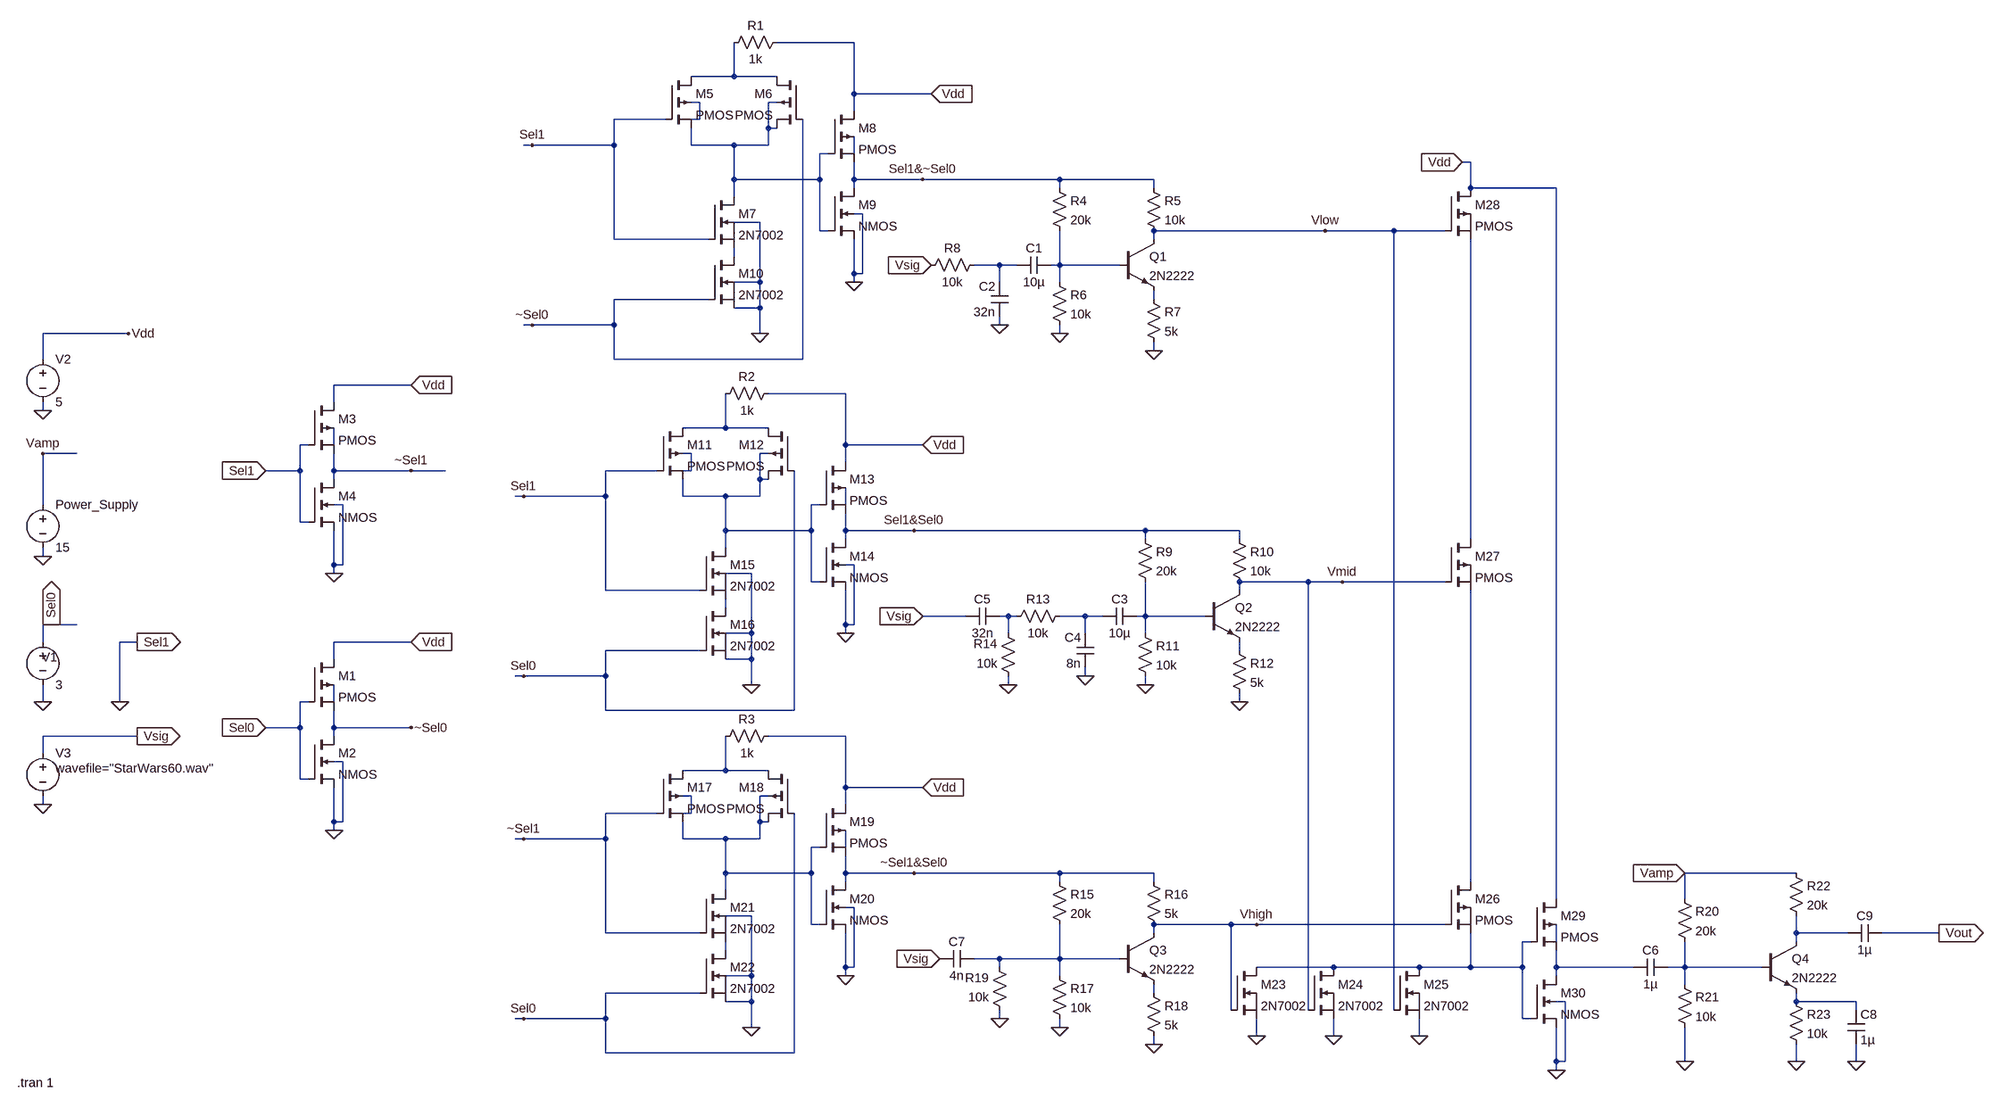
[diagram p0: schematic FinalDraft.asc]
FinalDraft.asc, the LTspice schematic file:
Version 4
SHEET 1 2692 1464
WIRE 176 -496 32 -496
WIRE -48 -432 -48 -496
WIRE -48 -432 -128 -432
WIRE 32 -432 -48 -432
WIRE 176 -400 176 -496
WIRE 320 -400 176 -400
WIRE -112 -384 -128 -384
WIRE 32 -384 16 -384
WIRE 176 -368 176 -400
WIRE -176 -352 -272 -352
WIRE -112 -352 -112 -384
WIRE -112 -352 -128 -352
WIRE 16 -336 16 -384
WIRE 32 -336 16 -336
WIRE -512 -304 -528 -304
WIRE -272 -304 -272 -352
WIRE -272 -304 -512 -304
WIRE -128 -304 -128 -336
WIRE -48 -304 -128 -304
WIRE 16 -304 16 -336
WIRE 16 -304 -48 -304
WIRE 128 -288 112 -288
WIRE 176 -288 176 -320
WIRE 1328 -272 1312 -272
WIRE -48 -240 -48 -304
WIRE 112 -240 112 -288
WIRE 112 -240 -48 -240
WIRE 176 -240 176 -272
WIRE 304 -240 176 -240
WIRE 560 -240 304 -240
WIRE 736 -240 560 -240
WIRE 176 -224 176 -240
WIRE 560 -224 560 -240
WIRE 736 -224 736 -240
WIRE 1328 -224 1328 -272
WIRE 1488 -224 1328 -224
WIRE -48 -208 -48 -240
WIRE 192 -176 176 -176
WIRE 0 -160 -48 -160
WIRE 112 -144 112 -240
WIRE 128 -144 112 -144
WIRE 1056 -144 736 -144
WIRE 1184 -144 1056 -144
WIRE 1280 -144 1184 -144
WIRE -272 -128 -272 -304
WIRE -96 -128 -272 -128
WIRE 736 -128 736 -144
WIRE -48 -96 -48 -112
WIRE 448 -80 400 -80
WIRE 480 -80 448 -80
WIRE 560 -80 560 -144
WIRE 560 -80 544 -80
WIRE 672 -80 560 -80
WIRE 176 -64 176 -128
WIRE 192 -64 192 -176
WIRE 192 -64 176 -64
WIRE 0 -48 0 -160
WIRE 0 -48 -48 -48
WIRE 176 -48 176 -64
WIRE 448 -48 448 -80
WIRE 560 -48 560 -80
WIRE -96 -16 -272 -16
WIRE 736 -16 736 -32
WIRE 0 0 0 -48
WIRE 0 0 -48 0
WIRE -512 32 -528 32
WIRE -272 32 -272 -16
WIRE -272 32 -512 32
WIRE 448 32 448 16
WIRE -1296 48 -1456 48
WIRE 0 48 0 0
WIRE 560 48 560 32
WIRE 736 80 736 64
WIRE -1456 96 -1456 48
WIRE -272 96 -272 32
WIRE 80 96 80 -352
WIRE 80 96 -272 96
WIRE -768 144 -912 144
WIRE 160 160 16 160
WIRE -912 176 -912 144
WIRE -1456 192 -1456 176
WIRE -64 224 -64 160
WIRE -64 224 -144 224
WIRE 16 224 -64 224
WIRE -960 256 -976 256
WIRE -912 256 -912 224
WIRE 160 256 160 160
WIRE 304 256 160 256
WIRE -1392 272 -1456 272
WIRE -128 272 -144 272
WIRE 16 272 0 272
WIRE 160 288 160 256
WIRE -976 304 -976 256
WIRE -976 304 -1040 304
WIRE -912 304 -912 272
WIRE -768 304 -912 304
WIRE -704 304 -768 304
WIRE -192 304 -288 304
WIRE -128 304 -128 272
WIRE -128 304 -144 304
WIRE -912 320 -912 304
WIRE 0 320 0 272
WIRE 16 320 0 320
WIRE -528 352 -544 352
WIRE -288 352 -288 304
WIRE -288 352 -528 352
WIRE -144 352 -144 320
WIRE -64 352 -144 352
WIRE 0 352 0 320
WIRE 0 352 -64 352
WIRE -1456 368 -1456 272
WIRE -896 368 -912 368
WIRE 112 368 96 368
WIRE 160 368 160 336
WIRE -976 400 -976 304
WIRE -960 400 -976 400
WIRE -64 416 -64 352
WIRE 96 416 96 368
WIRE 96 416 -64 416
WIRE 160 416 160 384
WIRE 288 416 160 416
WIRE 720 416 288 416
WIRE 896 416 720 416
WIRE 160 432 160 416
WIRE 720 432 720 416
WIRE 896 432 896 416
WIRE 1328 432 1328 -128
WIRE -64 448 -64 416
WIRE -1456 464 -1456 448
WIRE -912 480 -912 416
WIRE -896 480 -896 368
WIRE -896 480 -912 480
WIRE 176 480 160 480
WIRE -912 496 -912 480
WIRE -16 496 -64 496
WIRE 96 512 96 416
WIRE 112 512 96 512
WIRE 1024 512 896 512
WIRE 1088 512 1024 512
WIRE 1280 512 1088 512
WIRE -288 528 -288 352
WIRE -112 528 -288 528
WIRE 896 528 896 512
WIRE -64 560 -64 544
WIRE 384 576 304 576
WIRE 464 576 448 576
WIRE 480 576 464 576
WIRE 608 576 560 576
WIRE 640 576 608 576
WIRE 720 576 720 512
WIRE 720 576 704 576
WIRE 832 576 720 576
WIRE -1440 592 -1456 592
WIRE -1392 592 -1440 592
WIRE 160 592 160 528
WIRE 176 592 176 480
WIRE 176 592 160 592
WIRE -16 608 -16 496
WIRE -16 608 -64 608
WIRE 160 608 160 592
WIRE 464 608 464 576
WIRE 608 608 608 576
WIRE 720 608 720 576
WIRE -1456 624 -1456 592
WIRE -1280 624 -1312 624
WIRE -768 624 -912 624
WIRE -112 640 -288 640
WIRE 896 640 896 624
WIRE -912 656 -912 624
WIRE -16 656 -16 608
WIRE -16 656 -64 656
WIRE -528 688 -544 688
WIRE -288 688 -288 640
WIRE -288 688 -528 688
WIRE 608 688 608 672
WIRE -16 704 -16 656
WIRE 464 704 464 688
WIRE 720 704 720 688
WIRE -1456 736 -1456 704
WIRE -1312 736 -1312 624
WIRE -960 736 -976 736
WIRE -912 736 -912 704
WIRE 896 736 896 720
WIRE -288 752 -288 688
WIRE 64 752 64 304
WIRE 64 752 -288 752
WIRE -976 784 -976 736
WIRE -976 784 -1040 784
WIRE -912 784 -912 752
WIRE -768 784 -912 784
WIRE -1280 800 -1456 800
WIRE -912 800 -912 784
WIRE 160 800 16 800
WIRE -1456 832 -1456 800
WIRE -896 848 -912 848
WIRE -64 864 -64 800
WIRE -64 864 -144 864
WIRE 16 864 -64 864
WIRE -976 880 -976 784
WIRE -960 880 -976 880
WIRE 160 896 160 800
WIRE 304 896 160 896
WIRE -128 912 -144 912
WIRE 16 912 0 912
WIRE -1456 928 -1456 912
WIRE 160 928 160 896
WIRE -192 944 -288 944
WIRE -128 944 -128 912
WIRE -128 944 -144 944
WIRE -912 960 -912 896
WIRE -896 960 -896 848
WIRE -896 960 -912 960
WIRE 0 960 0 912
WIRE 16 960 0 960
WIRE -912 976 -912 960
WIRE -528 992 -544 992
WIRE -288 992 -288 944
WIRE -288 992 -528 992
WIRE -144 992 -144 960
WIRE -64 992 -144 992
WIRE 0 992 0 960
WIRE 0 992 -64 992
WIRE 112 1008 96 1008
WIRE 160 1008 160 976
WIRE -64 1056 -64 992
WIRE 96 1056 96 1008
WIRE 96 1056 -64 1056
WIRE 160 1056 160 1024
WIRE 288 1056 160 1056
WIRE 560 1056 288 1056
WIRE 736 1056 560 1056
WIRE 1936 1056 1728 1056
WIRE 160 1072 160 1056
WIRE 560 1072 560 1056
WIRE 736 1072 736 1056
WIRE 1328 1072 1328 528
WIRE -64 1088 -64 1056
WIRE 1488 1104 1488 -224
WIRE 1728 1104 1728 1056
WIRE 176 1120 160 1120
WIRE -16 1136 -64 1136
WIRE 96 1152 96 1056
WIRE 112 1152 96 1152
WIRE 880 1152 736 1152
WIRE 928 1152 880 1152
WIRE 1280 1152 928 1152
WIRE -288 1168 -288 992
WIRE -112 1168 -288 1168
WIRE 736 1168 736 1152
WIRE 1936 1168 1936 1136
WIRE 2032 1168 1936 1168
WIRE 2224 1168 2096 1168
WIRE 1440 1184 1424 1184
WIRE 1488 1184 1488 1152
WIRE 1936 1184 1936 1168
WIRE -64 1200 -64 1184
WIRE 448 1216 400 1216
WIRE 560 1216 560 1152
WIRE 560 1216 448 1216
WIRE 672 1216 560 1216
WIRE 160 1232 160 1168
WIRE 176 1232 176 1120
WIRE 176 1232 160 1232
WIRE 448 1232 448 1216
WIRE 1072 1232 928 1232
WIRE 1232 1232 1072 1232
WIRE 1328 1232 1328 1168
WIRE 1328 1232 1232 1232
WIRE 1424 1232 1424 1184
WIRE 1424 1232 1328 1232
WIRE 1488 1232 1488 1200
WIRE 1632 1232 1488 1232
WIRE 1728 1232 1728 1184
WIRE 1728 1232 1696 1232
WIRE 1872 1232 1728 1232
WIRE -16 1248 -16 1136
WIRE -16 1248 -64 1248
WIRE 160 1248 160 1232
WIRE 560 1248 560 1216
WIRE 1488 1248 1488 1232
WIRE 1728 1264 1728 1232
WIRE -112 1280 -288 1280
WIRE 736 1280 736 1264
WIRE -16 1296 -16 1248
WIRE -16 1296 -64 1296
WIRE 1504 1296 1488 1296
WIRE 1936 1296 1936 1280
WIRE 2048 1296 1936 1296
WIRE 880 1312 880 1152
WIRE 1024 1312 1024 512
WIRE 1184 1312 1184 -144
WIRE 2048 1312 2048 1296
WIRE -528 1328 -544 1328
WIRE -288 1328 -288 1280
WIRE -288 1328 -528 1328
WIRE 448 1328 448 1312
WIRE 1424 1328 1424 1232
WIRE 1440 1328 1424 1328
WIRE -16 1344 -16 1296
WIRE 560 1344 560 1328
WIRE 928 1360 928 1328
WIRE 1072 1360 1072 1328
WIRE 1232 1360 1232 1328
WIRE 736 1376 736 1360
WIRE -288 1392 -288 1328
WIRE 64 1392 64 944
WIRE 64 1392 -288 1392
WIRE 1488 1408 1488 1344
WIRE 1504 1408 1504 1296
WIRE 1504 1408 1488 1408
WIRE 1728 1408 1728 1344
WIRE 1936 1408 1936 1376
WIRE 2048 1408 2048 1376
WIRE 1488 1424 1488 1408
FLAG -1456 464 0
FLAG -912 976 0
FLAG -1296 48 Vdd
FLAG -1040 784 Sel0
IOPIN -1040 784 In
FLAG -768 624 Vdd
IOPIN -768 624 In
FLAG -768 784 ~Sel0
FLAG -912 496 0
FLAG -1040 304 Sel1
IOPIN -1040 304 In
FLAG -768 144 Vdd
IOPIN -768 144 In
FLAG -768 304 ~Sel1
FLAG 0 48 0
FLAG 176 -48 0
FLAG 320 -400 Vdd
IOPIN 320 -400 In
FLAG 304 -240 Sel1&~Sel0
FLAG -512 -304 Sel1
FLAG -512 32 ~Sel0
FLAG -16 704 0
FLAG 160 608 0
FLAG 304 256 Vdd
IOPIN 304 256 In
FLAG 288 416 Sel1&Sel0
FLAG -528 352 Sel1
FLAG -528 688 Sel0
FLAG -16 1344 0
FLAG 160 1248 0
FLAG 304 896 Vdd
IOPIN 304 896 In
FLAG 288 1056 ~Sel1&Sel0
FLAG -528 992 ~Sel1
FLAG -528 1328 Sel0
FLAG 320 -80 Vsig
IOPIN 320 -80 In
FLAG 736 80 0
FLAG 560 48 0
FLAG 448 32 0
FLAG 304 576 Vsig
IOPIN 304 576 In
FLAG 896 736 0
FLAG 720 704 0
FLAG 608 688 0
FLAG 464 704 0
FLAG 336 1216 Vsig
IOPIN 336 1216 In
FLAG 736 1376 0
FLAG 560 1344 0
FLAG 448 1328 0
FLAG 928 1360 0
FLAG 1072 1360 0
FLAG 1232 1360 0
FLAG 1488 1424 0
FLAG 1312 -272 Vdd
IOPIN 1312 -272 In
FLAG 1936 1408 0
FLAG 2048 1408 0
FLAG 1728 1408 0
FLAG 2224 1168 Vout
IOPIN 2224 1168 Out
FLAG -1456 272 Vamp
FLAG -1456 736 0
FLAG -1312 736 0
FLAG -1456 928 0
FLAG -1280 800 Vsig
IOPIN -1280 800 Out
FLAG -1440 592 Sel0
IOPIN -1440 592 Out
FLAG -1280 624 Sel1
IOPIN -1280 624 Out
FLAG 1728 1056 Vamp
IOPIN 1728 1056 In
FLAG -1456 192 0
FLAG 1056 -144 Vlow
FLAG 1088 512 Vmid
FLAG 928 1152 Vhigh
SYMBOL voltage -1456 352 R0
WINDOW 123 0 0 Left 0
WINDOW 39 0 0 Left 0
SYMATTR InstName Power_Supply
SYMATTR Value 15
SYMBOL pmos4 -960 656 R0
SYMATTR InstName M1
SYMBOL nmos4 -960 800 R0
SYMATTR InstName M2
SYMBOL pmos4 -960 176 R0
SYMATTR InstName M3
SYMBOL nmos4 -960 320 R0
SYMATTR InstName M4
SYMBOL pmos4 -176 -432 R0
SYMATTR InstName M5
SYMBOL pmos4 80 -432 M0
SYMATTR InstName M6
SYMBOL pmos4 128 -368 R0
SYMATTR InstName M8
SYMBOL nmos4 128 -224 R0
SYMATTR InstName M9
SYMBOL nmos -96 -208 R0
SYMATTR InstName M7
SYMATTR Value 2N7002
SYMBOL nmos -96 -96 R0
SYMATTR InstName M10
SYMATTR Value 2N7002
SYMBOL res 48 -512 R90
WINDOW 0 0 56 VBottom 2
WINDOW 3 32 56 VTop 2
SYMATTR InstName R1
SYMATTR Value 1k
SYMBOL pmos4 -192 224 R0
SYMATTR InstName M11
SYMBOL pmos4 64 224 M0
SYMATTR InstName M12
SYMBOL pmos4 112 288 R0
SYMATTR InstName M13
SYMBOL nmos4 112 432 R0
SYMATTR InstName M14
SYMBOL nmos -112 448 R0
SYMATTR InstName M15
SYMATTR Value 2N7002
SYMBOL nmos -112 560 R0
SYMATTR InstName M16
SYMATTR Value 2N7002
SYMBOL res 32 144 R90
WINDOW 0 0 56 VBottom 2
WINDOW 3 32 56 VTop 2
SYMATTR InstName R2
SYMATTR Value 1k
SYMBOL pmos4 -192 864 R0
SYMATTR InstName M17
SYMBOL pmos4 64 864 M0
SYMATTR InstName M18
SYMBOL pmos4 112 928 R0
SYMATTR InstName M19
SYMBOL nmos4 112 1072 R0
SYMATTR InstName M20
SYMBOL nmos -112 1088 R0
SYMATTR InstName M21
SYMATTR Value 2N7002
SYMBOL nmos -112 1200 R0
SYMATTR InstName M22
SYMATTR Value 2N7002
SYMBOL res 32 784 R90
WINDOW 0 0 56 VBottom 2
WINDOW 3 32 56 VTop 2
SYMATTR InstName R3
SYMATTR Value 1k
SYMBOL res 544 -240 R0
SYMATTR InstName R4
SYMATTR Value 20k
SYMBOL res 720 -240 R0
SYMATTR InstName R5
SYMATTR Value 10k
SYMBOL res 544 -64 R0
SYMATTR InstName R6
SYMATTR Value 10k
SYMBOL res 720 -32 R0
SYMATTR InstName R7
SYMATTR Value 5k
SYMBOL npn 672 -128 R0
SYMATTR InstName Q1
SYMATTR Value 2N2222
SYMBOL cap 544 -96 R90
WINDOW 0 0 32 VBottom 2
WINDOW 3 32 32 VTop 2
SYMATTR InstName C1
SYMATTR Value 10µ
SYMBOL cap 464 16 R180
WINDOW 0 24 56 Left 2
WINDOW 3 24 8 Left 2
SYMATTR InstName C2
SYMATTR Value 32n
SYMBOL res 416 -96 R90
WINDOW 0 0 56 VBottom 2
WINDOW 3 32 56 VTop 2
SYMATTR InstName R8
SYMATTR Value 10k
SYMBOL res 704 416 R0
SYMATTR InstName R9
SYMATTR Value 20k
SYMBOL res 880 416 R0
SYMATTR InstName R10
SYMATTR Value 10k
SYMBOL res 704 592 R0
SYMATTR InstName R11
SYMATTR Value 10k
SYMBOL res 880 624 R0
SYMATTR InstName R12
SYMATTR Value 5k
SYMBOL npn 832 528 R0
SYMATTR InstName Q2
SYMATTR Value 2N2222
SYMBOL cap 704 560 R90
WINDOW 0 0 32 VBottom 2
WINDOW 3 32 32 VTop 2
SYMATTR InstName C3
SYMATTR Value 10µ
SYMBOL cap 624 672 R180
WINDOW 0 24 56 Left 2
WINDOW 3 24 8 Left 2
SYMATTR InstName C4
SYMATTR Value 8n
SYMBOL res 576 560 R90
WINDOW 0 0 56 VBottom 2
WINDOW 3 32 56 VTop 2
SYMATTR InstName R13
SYMATTR Value 10k
SYMBOL cap 448 560 R90
WINDOW 0 0 32 VBottom 2
WINDOW 3 32 32 VTop 2
SYMATTR InstName C5
SYMATTR Value 32n
SYMBOL res 480 704 R180
WINDOW 0 36 76 Left 2
WINDOW 3 36 40 Left 2
SYMATTR InstName R14
SYMATTR Value 10k
SYMBOL res 544 1056 R0
SYMATTR InstName R15
SYMATTR Value 20k
SYMBOL res 720 1056 R0
SYMATTR InstName R16
SYMATTR Value 5k
SYMBOL res 544 1232 R0
SYMATTR InstName R17
SYMATTR Value 10k
SYMBOL res 720 1264 R0
SYMATTR InstName R18
SYMATTR Value 5k
SYMBOL npn 672 1168 R0
SYMATTR InstName Q3
SYMATTR Value 2N2222
SYMBOL res 464 1328 R180
WINDOW 0 36 76 Left 2
WINDOW 3 36 40 Left 2
SYMATTR InstName R19
SYMATTR Value 10k
SYMBOL cap 400 1200 R90
WINDOW 0 0 32 VBottom 2
WINDOW 3 32 32 VTop 2
SYMATTR InstName C7
SYMATTR Value 4n
SYMBOL nmos 880 1232 R0
SYMATTR InstName M23
SYMATTR Value 2N7002
SYMBOL nmos 1024 1232 R0
SYMATTR InstName M24
SYMATTR Value 2N7002
SYMBOL nmos 1184 1232 R0
SYMATTR InstName M25
SYMATTR Value 2N7002
SYMBOL pmos 1280 1072 R0
SYMATTR InstName M26
SYMBOL pmos 1280 432 R0
SYMATTR InstName M27
SYMBOL pmos 1280 -224 R0
SYMATTR InstName M28
SYMBOL pmos4 1440 1104 R0
SYMATTR InstName M29
SYMBOL nmos4 1440 1248 R0
SYMATTR InstName M30
SYMBOL cap 1696 1216 R90
WINDOW 0 0 32 VBottom 2
WINDOW 3 32 32 VTop 2
SYMATTR InstName C6
SYMATTR Value 1µ
SYMBOL res 1712 1088 R0
SYMATTR InstName R20
SYMATTR Value 20k
SYMBOL res 1712 1248 R0
SYMATTR InstName R21
SYMATTR Value 10k
SYMBOL res 1920 1040 R0
SYMATTR InstName R22
SYMATTR Value 20k
SYMBOL res 1920 1280 R0
SYMATTR InstName R23
SYMATTR Value 10k
SYMBOL cap 2032 1312 R0
SYMATTR InstName C8
SYMATTR Value 1µ
SYMBOL npn 1872 1184 R0
SYMATTR InstName Q4
SYMATTR Value 2N2222
SYMBOL voltage -1456 608 R0
WINDOW 0 -2 45 Left 2
WINDOW 123 0 0 Left 0
WINDOW 39 0 0 Left 0
SYMATTR InstName V1
SYMATTR Value 3
SYMBOL voltage -1456 816 R0
WINDOW 3 24 44 Left 2
SYMATTR InstName V3
SYMATTR Value wavefile="StarWars60.wav"
SYMBOL voltage -1456 80 R0
WINDOW 123 0 0 Left 0
WINDOW 39 0 0 Left 0
SYMATTR InstName V2
SYMATTR Value 5
SYMBOL cap 2096 1152 R90
WINDOW 0 0 32 VBottom 2
WINDOW 3 32 32 VTop 2
SYMATTR InstName C9
SYMATTR Value 1µ
TEXT -1504 1448 Left 2 !.tran 1

The netlist it stands for:
* FinalDraft.asc
V§Power_Supply Vamp 0 15
M1 Vdd Sel0 ~Sel0 N020 PMOS
M2 ~Sel0 Sel0 0 0 NMOS
M3 Vdd 0 ~Sel1 N010 PMOS
M4 ~Sel1 0 0 0 NMOS
M5 N001 0 N003 N002 PMOS
M6 N001 ~Sel0 N003 N003 PMOS
M8 Vdd N003 Sel1&~Sel0 N004 PMOS
M9 Sel1&~Sel0 N003 0 0 NMOS
M7 N003 0 N005 N005 2N7002
M10 N005 ~Sel0 0 0 2N7002
R1 Vdd N001 1k
M11 N009 0 N012 N011 PMOS
M12 N009 Sel0 N012 N012 PMOS
M13 Vdd N012 Sel1&Sel0 N013 PMOS
M14 Sel1&Sel0 N012 0 0 NMOS
M15 N012 0 N015 N015 2N7002
M16 N015 Sel0 0 0 2N7002
R2 Vdd N009 1k
M17 N021 ~Sel1 N023 N022 PMOS
M18 N021 Sel0 N023 N023 PMOS
M19 Vdd N023 ~Sel1&Sel0 N024 PMOS
M20 ~Sel1&Sel0 N023 0 0 NMOS
M21 N023 ~Sel1 N029 N029 2N7002
M22 N029 Sel0 0 0 2N7002
R3 Vdd N021 1k
R4 Sel1&~Sel0 N007 20k
R5 Sel1&~Sel0 Vlow 10k
R6 N007 0 10k
R7 N008 0 5k
Q1 Vlow N007 N008 0 2N2222
C1 N007 N006 10µ
C2 0 N006 32n
R8 N006 Vsig 10k
R9 Sel1&Sel0 N018 20k
R10 Sel1&Sel0 Vmid 10k
R11 N018 0 10k
R12 N019 0 5k
Q2 Vmid N018 N019 0 2N2222
C3 N018 N017 10µ
C4 0 N017 8n
R13 N017 N016 10k
C5 N016 Vsig 32n
R14 0 N016 10k
R15 ~Sel1&Sel0 N030 20k
R16 ~Sel1&Sel0 Vhigh 5k
R17 N030 0 10k
R18 N033 0 5k
Q3 Vhigh N030 N033 0 2N2222
R19 0 N030 10k
C7 N030 Vsig 4n
M23 N027 Vhigh 0 0 2N7002
M24 N027 Vmid 0 0 2N7002
M25 N027 Vlow 0 0 2N7002
M26 N025 Vhigh N027 N027 PMOS
M27 N014 Vmid N025 N025 PMOS
M28 Vdd Vlow N014 N014 PMOS
M29 Vdd N027 N031 N028 PMOS
M30 N031 N027 0 0 NMOS
C6 N032 N031 1µ
R20 Vamp N032 20k
R21 N032 0 10k
R22 Vamp N026 20k
R23 N034 0 10k
C8 N034 0 1µ
Q4 N026 N032 N034 0 2N2222
V1 Sel0 0 3
V3 Vsig 0 wavefile="StarWars60.wav"
V2 Vdd 0 5
C9 Vout N026 1µ
.model NPN NPN
.model PNP PNP
.lib standard.bjt
.model NMOS NMOS
.model PMOS PMOS
.lib standard.mos
.tran 1
.backanno
.end